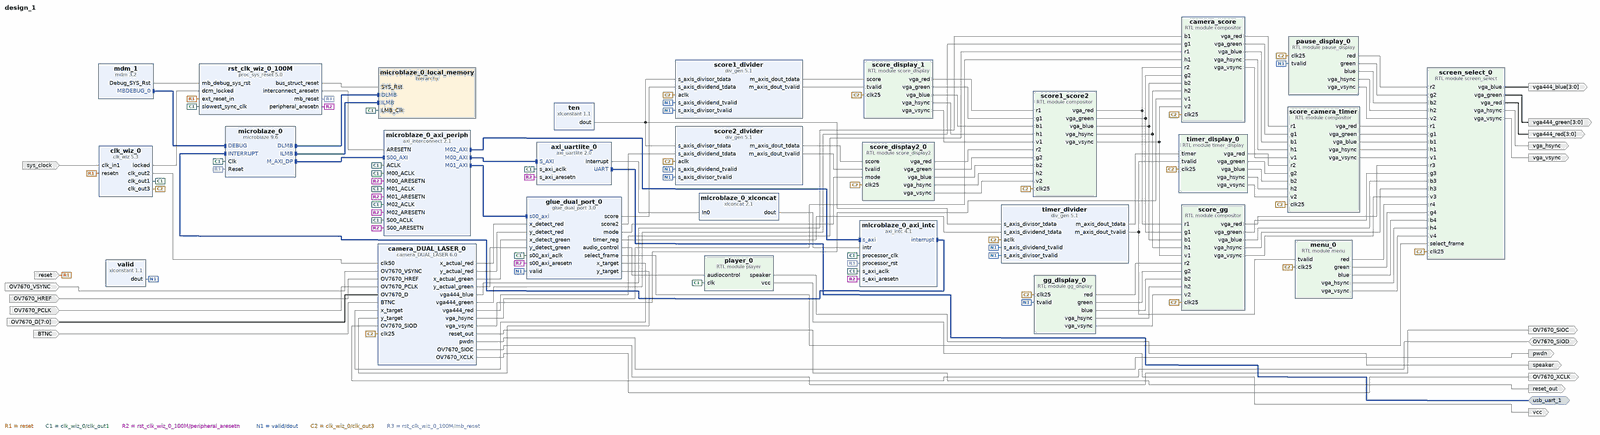
[diagram p0: block diagram of the top level, whole]
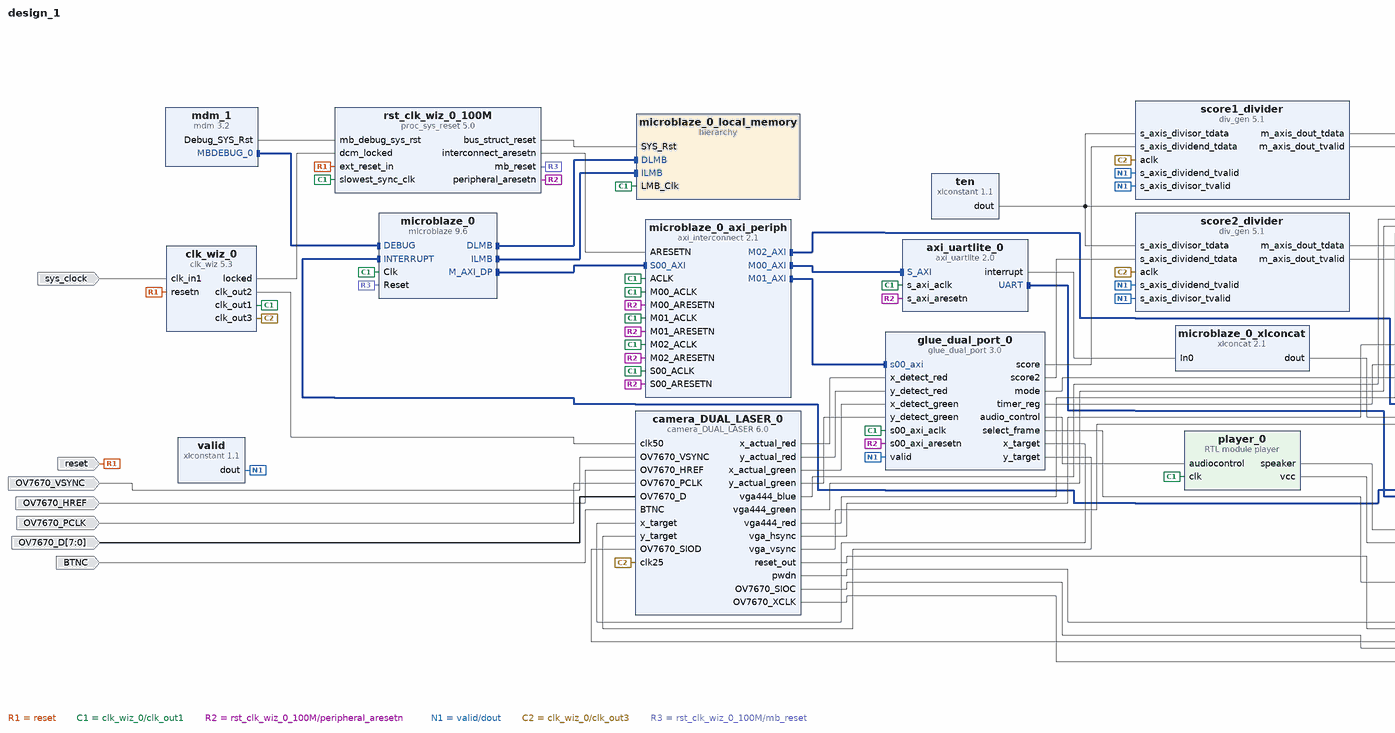
[diagram p1: block diagram of the top level, left part]
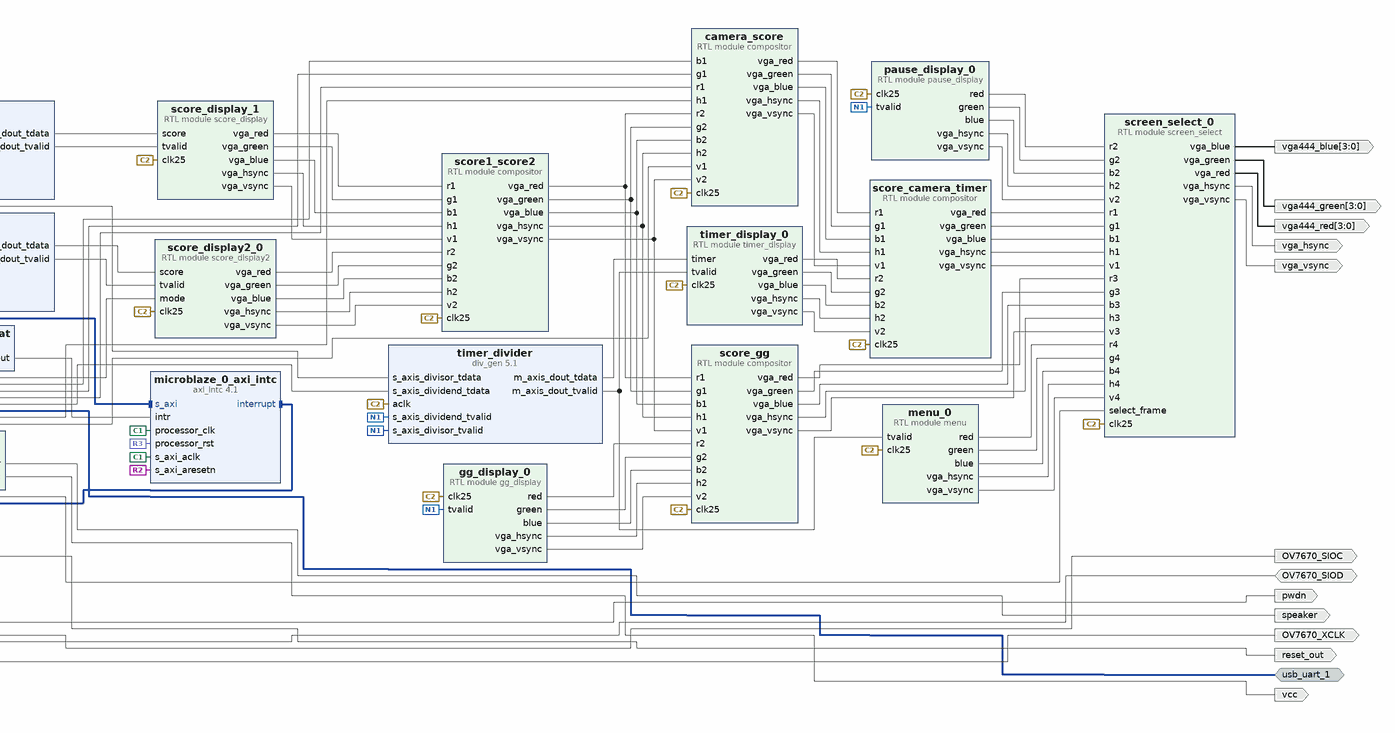
[diagram p2: block diagram of the top level, right part]
# Vivado block design design_1, Vivado 2016.2
create_bd_design design_1

create_bd_intf_port -mode Master -vlnv xilinx.com:interface:uart_rtl:1.0 usb_uart_1
create_bd_port -dir I -type rst reset
set_property -dict {CONFIG.POLARITY ACTIVE_LOW} [get_bd_ports reset]
create_bd_port -dir O -from 3 -to 0 vga444_red
create_bd_port -dir O -from 3 -to 0 vga444_green
create_bd_port -dir O -from 3 -to 0 vga444_blue
create_bd_port -dir O vga_hsync
create_bd_port -dir O vga_vsync
create_bd_port -dir O speaker
create_bd_port -dir O vcc
create_bd_port -dir I -type clk sys_clock
set_property -dict {CONFIG.FREQ_HZ 100000000 CONFIG.PHASE 0.000} [get_bd_ports sys_clock]
create_bd_port -dir I OV7670_VSYNC
create_bd_port -dir I OV7670_HREF
create_bd_port -dir I OV7670_PCLK
create_bd_port -dir I -from 7 -to 0 OV7670_D
create_bd_port -dir I BTNC
create_bd_port -dir O -type rst reset_out
create_bd_port -dir O pwdn
create_bd_port -dir IO OV7670_SIOD
create_bd_port -dir O OV7670_SIOC
create_bd_port -dir O OV7670_XCLK

create_bd_cell -type ip -vlnv xilinx.com:ip:clk_wiz:5.3 clk_wiz_0
set_property -dict [list \
  CONFIG.CLKOUT2_USED true \
  CONFIG.CLKOUT3_USED true \
  CONFIG.NUM_OUT_CLKS 3 \
  CONFIG.CLKOUT2_REQUESTED_OUT_FREQ 50 \
  CONFIG.CLKOUT3_REQUESTED_OUT_FREQ 25 \
  CONFIG.RESET_PORT resetn \
  CONFIG.MMCM_DIVCLK_DIVIDE 1 \
  CONFIG.MMCM_CLKOUT1_DIVIDE 20 \
  CONFIG.MMCM_CLKOUT2_DIVIDE 40 \
  CONFIG.RESET_TYPE ACTIVE_LOW \
  CONFIG.USE_BOARD_FLOW true \
  CONFIG.CLK_IN1_BOARD_INTERFACE sys_clock \
  CONFIG.RESET_BOARD_INTERFACE reset \
  CONFIG.CLKOUT2_JITTER 151.636 \
  CONFIG.CLKOUT2_PHASE_ERROR 98.575 \
  CONFIG.CLKOUT3_JITTER 175.402 \
  CONFIG.CLKOUT3_PHASE_ERROR 98.575 \
] [get_bd_cells clk_wiz_0]
create_bd_cell -type ip -vlnv xilinx.com:ip:xlconstant:1.1 valid
set_property -dict {CONFIG.CONST_WIDTH 1 CONFIG.CONST_VAL 1} [get_bd_cells valid]
create_bd_cell -type ip -vlnv xilinx.com:ip:proc_sys_reset:5.0 rst_clk_wiz_0_100M
set_property -dict {CONFIG.USE_BOARD_FLOW true CONFIG.RESET_BOARD_INTERFACE reset} [get_bd_cells rst_clk_wiz_0_100M]
create_bd_cell -type ip -vlnv xilinx.com:ip:axi_interconnect:2.1 microblaze_0_axi_periph
set_property -dict {CONFIG.NUM_MI 3} [get_bd_cells microblaze_0_axi_periph]
create_bd_cell -type ip -vlnv xilinx.com:ip:div_gen:5.1 score1_divider
create_bd_cell -type ip -vlnv xilinx.com:ip:xlconstant:1.1 ten
set_property -dict {CONFIG.CONST_WIDTH 16 CONFIG.CONST_VAL 10} [get_bd_cells ten]
create_bd_cell -type module -reference compositor camera_score
create_bd_cell -type module -reference pause_display pause_display_0
create_bd_cell -type ip -vlnv xilinx.com:ip:microblaze:9.6 microblaze_0
set_property -dict {CONFIG.C_D_AXI 1 CONFIG.C_D_LMB 1 CONFIG.C_I_LMB 1 CONFIG.C_DEBUG_ENABLED 1} [get_bd_cells microblaze_0]
create_bd_cell -type hier microblaze_0_local_memory
create_bd_cell -type ip -vlnv xilinx.com:ip:axi_intc:4.1 microblaze_0_axi_intc
set_property -dict {CONFIG.C_HAS_FAST 1} [get_bd_cells microblaze_0_axi_intc]
create_bd_cell -type ip -vlnv xilinx.com:ip:xlconcat:2.1 microblaze_0_xlconcat
set_property -dict {CONFIG.NUM_PORTS 1} [get_bd_cells microblaze_0_xlconcat]
create_bd_cell -type ip -vlnv xilinx.com:ip:mdm:3.2 mdm_1
create_bd_cell -type module -reference gg_display gg_display_0
create_bd_cell -type ip -vlnv xilinx.com:ip:div_gen:5.1 timer_divider
create_bd_cell -type ip -vlnv xilinx.com:ip:axi_uartlite:2.0 axi_uartlite_0
set_property -dict {CONFIG.USE_BOARD_FLOW true CONFIG.UARTLITE_BOARD_INTERFACE usb_uart} [get_bd_cells axi_uartlite_0]
create_bd_cell -type module -reference player player_0
create_bd_cell -type module -reference menu menu_0
create_bd_cell -type module -reference screen_select screen_select_0
create_bd_cell -type ip -vlnv utoronto.ca:user:camera_DUAL_LASER:6.0 camera_DUAL_LASER_0
create_bd_cell -type module -reference compositor score_camera_timer
create_bd_cell -type module -reference compositor score_gg
create_bd_cell -type ip -vlnv xilinx.com:ip:div_gen:5.1 score2_divider
create_bd_cell -type module -reference compositor score1_score2
create_bd_cell -type module -reference timer_display timer_display_0
create_bd_cell -type ip -vlnv utoronto.ca:user:glue_dual_port:3.0 glue_dual_port_0
create_bd_cell -type module -reference score_display2 score_display2_0
create_bd_cell -type module -reference score_display score_display_1

# ---- hierarchy /microblaze_0_local_memory ----
current_bd_instance /microblaze_0_local_memory
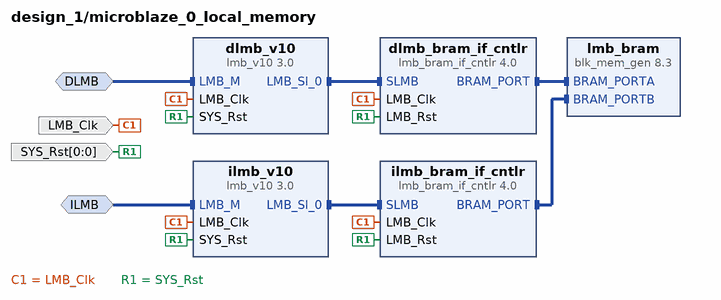
[diagram p3: block diagram inside /microblaze_0_local_memory]
create_bd_intf_pin -mode MirroredMaster -vlnv xilinx.com:interface:lmb_rtl:1.0 DLMB
create_bd_intf_pin -mode MirroredMaster -vlnv xilinx.com:interface:lmb_rtl:1.0 ILMB
create_bd_pin -dir I -type clk LMB_Clk
create_bd_pin -dir I -from 0 -to 0 -type rst SYS_Rst

create_bd_cell -type ip -vlnv xilinx.com:ip:lmb_v10:3.0 dlmb_v10
create_bd_cell -type ip -vlnv xilinx.com:ip:lmb_v10:3.0 ilmb_v10
create_bd_cell -type ip -vlnv xilinx.com:ip:lmb_bram_if_cntlr:4.0 dlmb_bram_if_cntlr
set_property -dict {CONFIG.C_ECC 0} [get_bd_cells dlmb_bram_if_cntlr]
create_bd_cell -type ip -vlnv xilinx.com:ip:lmb_bram_if_cntlr:4.0 ilmb_bram_if_cntlr
set_property -dict {CONFIG.C_ECC 0} [get_bd_cells ilmb_bram_if_cntlr]
create_bd_cell -type ip -vlnv xilinx.com:ip:blk_mem_gen:8.3 lmb_bram
set_property -dict {CONFIG.Memory_Type True_Dual_Port_RAM CONFIG.use_bram_block BRAM_Controller} [get_bd_cells lmb_bram]

# ---- connections ----

current_bd_instance /microblaze_0_local_memory
connect_bd_intf_net -intf_net microblaze_0_dlmb_bus [get_bd_intf_pins dlmb_v10/LMB_Sl_0] [get_bd_intf_pins dlmb_bram_if_cntlr/SLMB]
connect_bd_intf_net -intf_net microblaze_0_ilmb_bus [get_bd_intf_pins ilmb_v10/LMB_Sl_0] [get_bd_intf_pins ilmb_bram_if_cntlr/SLMB]
connect_bd_intf_net -intf_net microblaze_0_dlmb_cntlr [get_bd_intf_pins dlmb_bram_if_cntlr/BRAM_PORT] [get_bd_intf_pins lmb_bram/BRAM_PORTA]
connect_bd_intf_net -intf_net microblaze_0_ilmb_cntlr [get_bd_intf_pins ilmb_bram_if_cntlr/BRAM_PORT] [get_bd_intf_pins lmb_bram/BRAM_PORTB]
connect_bd_intf_net -intf_net microblaze_0_dlmb [get_bd_intf_pins DLMB] [get_bd_intf_pins dlmb_v10/LMB_M]
connect_bd_intf_net -intf_net microblaze_0_ilmb [get_bd_intf_pins ILMB] [get_bd_intf_pins ilmb_v10/LMB_M]
connect_bd_net -net microblaze_0_Clk [get_bd_pins LMB_Clk] \
  [get_bd_pins dlmb_v10/LMB_Clk] [get_bd_pins dlmb_bram_if_cntlr/LMB_Clk] [get_bd_pins ilmb_v10/LMB_Clk] \
  [get_bd_pins ilmb_bram_if_cntlr/LMB_Clk]
connect_bd_net [get_bd_pins SYS_Rst] \
  [get_bd_pins dlmb_v10/SYS_Rst] [get_bd_pins dlmb_bram_if_cntlr/LMB_Rst] [get_bd_pins ilmb_v10/SYS_Rst] \
  [get_bd_pins ilmb_bram_if_cntlr/LMB_Rst]

current_bd_instance /
connect_bd_intf_net [get_bd_intf_pins microblaze_0/DLMB] [get_bd_intf_pins microblaze_0_local_memory/DLMB]
connect_bd_intf_net [get_bd_intf_pins microblaze_0/ILMB] [get_bd_intf_pins microblaze_0_local_memory/ILMB]
connect_bd_intf_net -intf_net microblaze_0_axi_dp [get_bd_intf_pins microblaze_0_axi_periph/S00_AXI] [get_bd_intf_pins microblaze_0/M_AXI_DP]
connect_bd_intf_net [get_bd_intf_pins microblaze_0_axi_intc/interrupt] [get_bd_intf_pins microblaze_0/INTERRUPT]
connect_bd_intf_net -intf_net microblaze_0_intc_axi [get_bd_intf_pins microblaze_0_axi_periph/M02_AXI] [get_bd_intf_pins microblaze_0_axi_intc/s_axi]
connect_bd_intf_net [get_bd_intf_pins mdm_1/MBDEBUG_0] [get_bd_intf_pins microblaze_0/DEBUG]
connect_bd_intf_net [get_bd_intf_pins microblaze_0_axi_periph/M00_AXI] [get_bd_intf_pins axi_uartlite_0/S_AXI]
connect_bd_intf_net [get_bd_intf_pins microblaze_0_axi_periph/M01_AXI] [get_bd_intf_pins glue_dual_port_0/s00_axi]
connect_bd_intf_net [get_bd_intf_ports usb_uart_1] [get_bd_intf_pins axi_uartlite_0/UART]
connect_bd_net [get_bd_ports reset] [get_bd_pins clk_wiz_0/resetn] [get_bd_pins rst_clk_wiz_0_100M/ext_reset_in]
connect_bd_net -net microblaze_0_Clk [get_bd_pins clk_wiz_0/clk_out1] \
  [get_bd_pins rst_clk_wiz_0_100M/slowest_sync_clk] [get_bd_pins microblaze_0/Clk] \
  [get_bd_pins microblaze_0_axi_intc/s_axi_aclk] [get_bd_pins microblaze_0_axi_intc/processor_clk] \
  [get_bd_pins axi_uartlite_0/s_axi_aclk] [get_bd_pins player_0/clk] [get_bd_pins microblaze_0_axi_periph/ACLK] \
  [get_bd_pins microblaze_0_axi_periph/S00_ACLK] [get_bd_pins microblaze_0_axi_periph/M00_ACLK] \
  [get_bd_pins microblaze_0_axi_periph/M01_ACLK] [get_bd_pins microblaze_0_axi_periph/M02_ACLK] \
  [get_bd_pins microblaze_0_local_memory/LMB_Clk] [get_bd_pins glue_dual_port_0/s00_axi_aclk]
connect_bd_net [get_bd_pins clk_wiz_0/locked] [get_bd_pins rst_clk_wiz_0_100M/dcm_locked]
connect_bd_net [get_bd_pins rst_clk_wiz_0_100M/peripheral_aresetn] \
  [get_bd_pins microblaze_0_axi_intc/s_axi_aresetn] [get_bd_pins axi_uartlite_0/s_axi_aresetn] \
  [get_bd_pins microblaze_0_axi_periph/S00_ARESETN] [get_bd_pins microblaze_0_axi_periph/M00_ARESETN] \
  [get_bd_pins microblaze_0_axi_periph/M01_ARESETN] [get_bd_pins microblaze_0_axi_periph/M02_ARESETN] \
  [get_bd_pins glue_dual_port_0/s00_axi_aresetn]
connect_bd_net [get_bd_pins rst_clk_wiz_0_100M/interconnect_aresetn] [get_bd_pins microblaze_0_axi_periph/ARESETN]
connect_bd_net -net xlconstant_0_dout [get_bd_pins valid/dout] \
  [get_bd_pins score1_divider/s_axis_divisor_tvalid] [get_bd_pins score1_divider/s_axis_dividend_tvalid] \
  [get_bd_pins pause_display_0/tvalid] [get_bd_pins gg_display_0/tvalid] [get_bd_pins timer_divider/s_axis_dividend_tvalid] \
  [get_bd_pins timer_divider/s_axis_divisor_tvalid] [get_bd_pins score2_divider/s_axis_dividend_tvalid] \
  [get_bd_pins score2_divider/s_axis_divisor_tvalid] [get_bd_pins glue_dual_port_0/valid]
connect_bd_net [get_bd_pins clk_wiz_0/clk_out3] \
  [get_bd_pins score1_divider/aclk] [get_bd_pins camera_score/clk25] [get_bd_pins pause_display_0/clk25] \
  [get_bd_pins gg_display_0/clk25] [get_bd_pins timer_divider/aclk] [get_bd_pins menu_0/clk25] \
  [get_bd_pins screen_select_0/clk25] [get_bd_pins camera_DUAL_LASER_0/clk25] [get_bd_pins score_camera_timer/clk25] \
  [get_bd_pins score_gg/clk25] [get_bd_pins score1_score2/clk25] [get_bd_pins score2_divider/aclk] \
  [get_bd_pins timer_display_0/clk25] [get_bd_pins score_display2_0/clk25] [get_bd_pins score_display_1/clk25]
connect_bd_net [get_bd_pins ten/dout] \
  [get_bd_pins score1_divider/s_axis_divisor_tdata] [get_bd_pins timer_divider/s_axis_divisor_tdata] \
  [get_bd_pins score2_divider/s_axis_divisor_tdata]
connect_bd_net -net div_gen_0_m_axis_dout_tdata [get_bd_pins score1_divider/m_axis_dout_tdata] [get_bd_pins score_display_1/score]
connect_bd_net -net div_gen_0_m_axis_dout_tvalid [get_bd_pins score1_divider/m_axis_dout_tvalid] [get_bd_pins score_display_1/tvalid]
connect_bd_net -net score_display_0_vga_red [get_bd_pins score1_score2/vga_red] [get_bd_pins camera_score/r2] [get_bd_pins score_gg/r1]
connect_bd_net -net score_display_0_vga_green [get_bd_pins score1_score2/vga_green] [get_bd_pins camera_score/g2] [get_bd_pins score_gg/g1]
connect_bd_net -net score_display_0_vga_blue [get_bd_pins score1_score2/vga_blue] [get_bd_pins camera_score/b2] [get_bd_pins score_gg/b1]
connect_bd_net -net score_display_0_vga_hsync [get_bd_pins score1_score2/vga_hsync] [get_bd_pins camera_score/h2] [get_bd_pins score_gg/h1]
connect_bd_net -net score_display_0_vga_vsync [get_bd_pins score1_score2/vga_vsync] [get_bd_pins camera_score/v2] [get_bd_pins score_gg/v1]
connect_bd_net [get_bd_pins screen_select_0/vga_red] [get_bd_ports vga444_red]
connect_bd_net [get_bd_pins screen_select_0/vga_green] [get_bd_ports vga444_green]
connect_bd_net [get_bd_pins screen_select_0/vga_blue] [get_bd_ports vga444_blue]
connect_bd_net [get_bd_pins screen_select_0/vga_hsync] [get_bd_ports vga_hsync]
connect_bd_net [get_bd_pins screen_select_0/vga_vsync] [get_bd_ports vga_vsync]
connect_bd_net [get_bd_pins pause_display_0/red] [get_bd_pins screen_select_0/r2]
connect_bd_net [get_bd_pins pause_display_0/green] [get_bd_pins screen_select_0/g2]
connect_bd_net [get_bd_pins pause_display_0/blue] [get_bd_pins screen_select_0/b2]
connect_bd_net [get_bd_pins pause_display_0/vga_hsync] [get_bd_pins screen_select_0/h2]
connect_bd_net [get_bd_pins pause_display_0/vga_vsync] [get_bd_pins screen_select_0/v2]
connect_bd_net -net microblaze_0_intr [get_bd_pins microblaze_0_xlconcat/dout] [get_bd_pins microblaze_0_axi_intc/intr]
connect_bd_net [get_bd_pins rst_clk_wiz_0_100M/mb_reset] [get_bd_pins microblaze_0/Reset] [get_bd_pins microblaze_0_axi_intc/processor_rst]
connect_bd_net [get_bd_pins rst_clk_wiz_0_100M/bus_struct_reset] [get_bd_pins microblaze_0_local_memory/SYS_Rst]
connect_bd_net [get_bd_pins mdm_1/Debug_SYS_Rst] [get_bd_pins rst_clk_wiz_0_100M/mb_debug_sys_rst]
connect_bd_net [get_bd_pins gg_display_0/red] [get_bd_pins score_gg/r2]
connect_bd_net [get_bd_pins gg_display_0/green] [get_bd_pins score_gg/g2]
connect_bd_net [get_bd_pins gg_display_0/blue] [get_bd_pins score_gg/b2]
connect_bd_net [get_bd_pins gg_display_0/vga_hsync] [get_bd_pins score_gg/h2]
connect_bd_net [get_bd_pins gg_display_0/vga_vsync] [get_bd_pins score_gg/v2]
connect_bd_net -net compositor_1_vga_red [get_bd_pins score_gg/vga_red] [get_bd_pins screen_select_0/r3]
connect_bd_net -net compositor_1_vga_green [get_bd_pins score_gg/vga_green] [get_bd_pins screen_select_0/g3]
connect_bd_net -net compositor_1_vga_blue [get_bd_pins score_gg/vga_blue] [get_bd_pins screen_select_0/b3]
connect_bd_net -net compositor_1_vga_hsync [get_bd_pins score_gg/vga_hsync] [get_bd_pins screen_select_0/h3]
connect_bd_net -net compositor_1_vga_vsync [get_bd_pins score_gg/vga_vsync] [get_bd_pins screen_select_0/v3]
connect_bd_net [get_bd_pins player_0/speaker] [get_bd_ports speaker]
connect_bd_net [get_bd_pins player_0/vcc] [get_bd_ports vcc]
connect_bd_net -net div_gen_1_m_axis_dout_tdata [get_bd_pins timer_divider/m_axis_dout_tdata] [get_bd_pins timer_display_0/timer]
connect_bd_net -net div_gen_1_m_axis_dout_tvalid [get_bd_pins timer_divider/m_axis_dout_tvalid] \
  [get_bd_pins menu_0/tvalid] [get_bd_pins timer_display_0/tvalid]
connect_bd_net [get_bd_pins camera_score/vga_red] [get_bd_pins score_camera_timer/r1]
connect_bd_net [get_bd_pins camera_score/vga_green] [get_bd_pins score_camera_timer/g1]
connect_bd_net [get_bd_pins camera_score/vga_blue] [get_bd_pins score_camera_timer/b1]
connect_bd_net [get_bd_pins camera_score/vga_hsync] [get_bd_pins score_camera_timer/h1]
connect_bd_net [get_bd_pins camera_score/vga_vsync] [get_bd_pins score_camera_timer/v1]
connect_bd_net [get_bd_pins timer_display_0/vga_red] [get_bd_pins score_camera_timer/r2]
connect_bd_net [get_bd_pins timer_display_0/vga_green] [get_bd_pins score_camera_timer/g2]
connect_bd_net [get_bd_pins timer_display_0/vga_blue] [get_bd_pins score_camera_timer/b2]
connect_bd_net [get_bd_pins timer_display_0/vga_hsync] [get_bd_pins score_camera_timer/h2]
connect_bd_net [get_bd_pins timer_display_0/vga_vsync] [get_bd_pins score_camera_timer/v2]
connect_bd_net [get_bd_pins score_camera_timer/vga_red] [get_bd_pins screen_select_0/r1]
connect_bd_net [get_bd_pins score_camera_timer/vga_green] [get_bd_pins screen_select_0/g1]
connect_bd_net [get_bd_pins score_camera_timer/vga_blue] [get_bd_pins screen_select_0/b1]
connect_bd_net [get_bd_pins score_camera_timer/vga_hsync] [get_bd_pins screen_select_0/h1]
connect_bd_net [get_bd_pins score_camera_timer/vga_vsync] [get_bd_pins screen_select_0/v1]
connect_bd_net [get_bd_ports sys_clock] [get_bd_pins clk_wiz_0/clk_in1]
connect_bd_net [get_bd_pins axi_uartlite_0/interrupt] [get_bd_pins microblaze_0_xlconcat/In0]
connect_bd_net [get_bd_pins menu_0/red] [get_bd_pins screen_select_0/r4]
connect_bd_net [get_bd_pins menu_0/green] [get_bd_pins screen_select_0/g4]
connect_bd_net [get_bd_pins menu_0/blue] [get_bd_pins screen_select_0/b4]
connect_bd_net [get_bd_pins menu_0/vga_hsync] [get_bd_pins screen_select_0/h4]
connect_bd_net [get_bd_pins menu_0/vga_vsync] [get_bd_pins screen_select_0/v4]
connect_bd_net [get_bd_pins clk_wiz_0/clk_out2] [get_bd_pins camera_DUAL_LASER_0/clk50]
connect_bd_net [get_bd_ports OV7670_VSYNC] [get_bd_pins camera_DUAL_LASER_0/OV7670_VSYNC]
connect_bd_net [get_bd_ports OV7670_HREF] [get_bd_pins camera_DUAL_LASER_0/OV7670_HREF]
connect_bd_net [get_bd_ports OV7670_PCLK] [get_bd_pins camera_DUAL_LASER_0/OV7670_PCLK]
connect_bd_net [get_bd_ports OV7670_D] [get_bd_pins camera_DUAL_LASER_0/OV7670_D]
connect_bd_net [get_bd_ports BTNC] [get_bd_pins camera_DUAL_LASER_0/BTNC]
connect_bd_net [get_bd_pins camera_DUAL_LASER_0/vga444_blue] [get_bd_pins camera_score/b1]
connect_bd_net [get_bd_pins camera_DUAL_LASER_0/vga444_green] [get_bd_pins camera_score/g1]
connect_bd_net [get_bd_pins camera_DUAL_LASER_0/vga444_red] [get_bd_pins camera_score/r1]
connect_bd_net [get_bd_pins camera_DUAL_LASER_0/vga_hsync] [get_bd_pins camera_score/h1]
connect_bd_net [get_bd_pins camera_DUAL_LASER_0/vga_vsync] [get_bd_pins camera_score/v1]
connect_bd_net [get_bd_pins camera_DUAL_LASER_0/reset_out] [get_bd_ports reset_out]
connect_bd_net [get_bd_pins camera_DUAL_LASER_0/pwdn] [get_bd_ports pwdn]
connect_bd_net [get_bd_ports OV7670_SIOD] [get_bd_pins camera_DUAL_LASER_0/OV7670_SIOD]
connect_bd_net [get_bd_pins camera_DUAL_LASER_0/OV7670_SIOC] [get_bd_ports OV7670_SIOC]
connect_bd_net [get_bd_pins camera_DUAL_LASER_0/OV7670_XCLK] [get_bd_ports OV7670_XCLK]
connect_bd_net [get_bd_pins score_display_1/vga_red] [get_bd_pins score1_score2/r1]
connect_bd_net [get_bd_pins score_display_1/vga_green] [get_bd_pins score1_score2/g1]
connect_bd_net [get_bd_pins score_display_1/vga_blue] [get_bd_pins score1_score2/b1]
connect_bd_net [get_bd_pins score_display_1/vga_hsync] [get_bd_pins score1_score2/h1]
connect_bd_net [get_bd_pins score_display_1/vga_vsync] [get_bd_pins score1_score2/v1]
connect_bd_net [get_bd_pins score_display2_0/vga_red] [get_bd_pins score1_score2/r2]
connect_bd_net [get_bd_pins score_display2_0/vga_green] [get_bd_pins score1_score2/g2]
connect_bd_net [get_bd_pins score_display2_0/vga_blue] [get_bd_pins score1_score2/b2]
connect_bd_net [get_bd_pins score_display2_0/vga_hsync] [get_bd_pins score1_score2/h2]
connect_bd_net [get_bd_pins score_display2_0/vga_vsync] [get_bd_pins score1_score2/v2]
connect_bd_net [get_bd_pins score2_divider/m_axis_dout_tdata] [get_bd_pins score_display2_0/score]
connect_bd_net [get_bd_pins score2_divider/m_axis_dout_tvalid] [get_bd_pins score_display2_0/tvalid]
connect_bd_net [get_bd_pins camera_DUAL_LASER_0/x_actual_red] [get_bd_pins glue_dual_port_0/x_detect_red]
connect_bd_net [get_bd_pins camera_DUAL_LASER_0/y_actual_red] [get_bd_pins glue_dual_port_0/y_detect_red]
connect_bd_net [get_bd_pins camera_DUAL_LASER_0/x_actual_green] [get_bd_pins glue_dual_port_0/x_detect_green]
connect_bd_net [get_bd_pins camera_DUAL_LASER_0/y_actual_green] [get_bd_pins glue_dual_port_0/y_detect_green]
connect_bd_net [get_bd_pins glue_dual_port_0/x_target] [get_bd_pins camera_DUAL_LASER_0/x_target]
connect_bd_net [get_bd_pins glue_dual_port_0/y_target] [get_bd_pins camera_DUAL_LASER_0/y_target]
connect_bd_net [get_bd_pins glue_dual_port_0/score] [get_bd_pins score1_divider/s_axis_dividend_tdata]
connect_bd_net [get_bd_pins glue_dual_port_0/score2] [get_bd_pins score2_divider/s_axis_dividend_tdata]
connect_bd_net [get_bd_pins glue_dual_port_0/select_frame] [get_bd_pins screen_select_0/select_frame]
connect_bd_net [get_bd_pins glue_dual_port_0/timer_reg] [get_bd_pins timer_divider/s_axis_dividend_tdata]
connect_bd_net [get_bd_pins glue_dual_port_0/audio_control] [get_bd_pins player_0/audiocontrol]
connect_bd_net [get_bd_pins glue_dual_port_0/mode] [get_bd_pins score_display2_0/mode]

# ---- address map ----
assign_bd_address -offset 0x00000000 -range 64K -target_address_space [get_bd_addr_spaces microblaze_0/Data] [get_bd_addr_segs microblaze_0_local_memory/dlmb_bram_if_cntlr/SLMB/Mem]
assign_bd_address -offset 0x40600000 -range 64K -target_address_space [get_bd_addr_spaces microblaze_0/Data] [get_bd_addr_segs axi_uartlite_0/S_AXI/Reg]
assign_bd_address -offset 0x41200000 -range 64K -target_address_space [get_bd_addr_spaces microblaze_0/Data] [get_bd_addr_segs microblaze_0_axi_intc/S_AXI/Reg]
assign_bd_address -offset 0x44A00000 -range 64K -target_address_space [get_bd_addr_spaces microblaze_0/Data] [get_bd_addr_segs glue_dual_port_0/s00_axi/reg0]
assign_bd_address -offset 0x00000000 -range 64K -target_address_space [get_bd_addr_spaces microblaze_0/Instruction] [get_bd_addr_segs microblaze_0_local_memory/ilmb_bram_if_cntlr/SLMB/Mem]

validate_bd_design
save_bd_design
